# Altium project Protótipo_ProjetoBotão.PrjPcb (part 3 of 4)
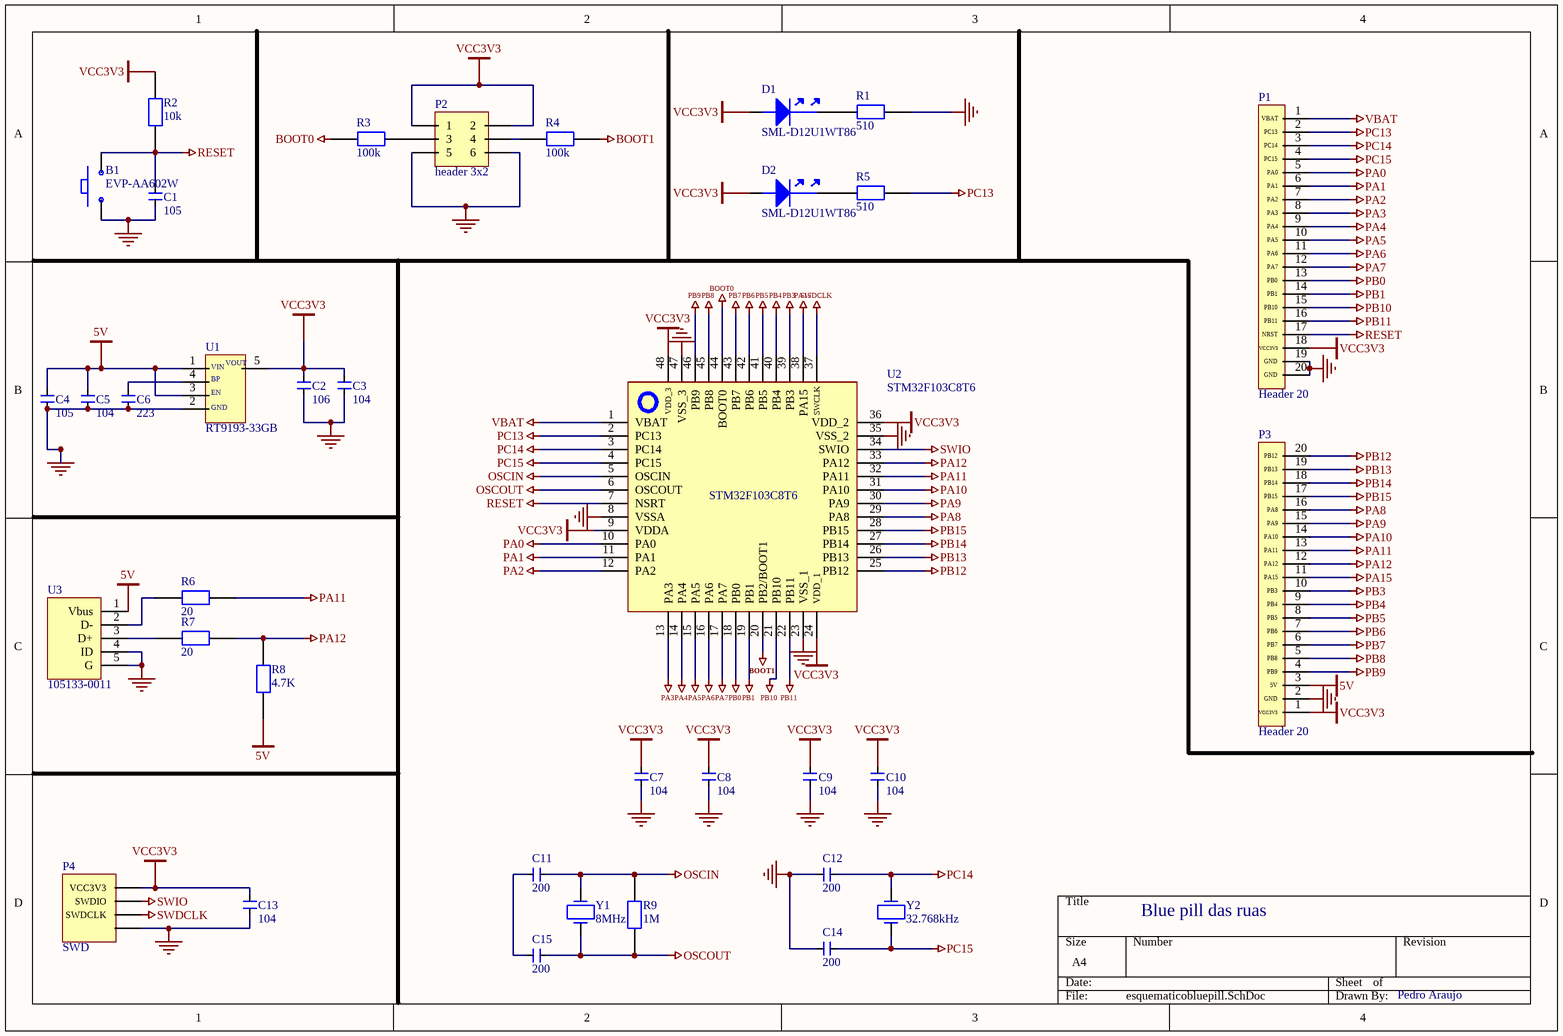
[diagram p3: esquematicobluepill.SchDoc]

## Sheet esquematicobluepill.SchDoc (continued)

### Library data of the parts (continued)
R1 R5 = ERJ-PA3F5100V: Res Thick Film 0603 510 Ohm 1% 0.25W(1/4W) +/-100ppm/C Molded SMD Automotive Punched T/R; Manufacturer: Panasonic; Max Power Dissipation: 250mW; Value: 510Ω; Temperature Coefficient: 100ppm/°C; Voltage Rating: 150V; Supplier: DigiKey; Supplier Part Number: P510BYCT-ND; Manufacturer Part Number: ERJ-PA3F5100V; RoHS: Compliant; Category: Chip SMD Resistors; Stock: 32893; Pricing: 1=0,14, 10=0,068, 25=0,0532, 50=0,0446, 100=0,0378, 250=0,031, 500=0,02712, 1000=0,02404 (USD); Case/Package: 0603; Case Code (Imperial): 0603; Case Code (Metric): 1608; Composition: Thick Film; Depth: 800µm; Features: Automotive AEC-Q200; Height: 450µm; Length: 1.6002mm; Lifecycle Status: Production; Max Operating Temperature: 155°C; Min Operating Temperature: -55°C; Mounting Technology: Surface Mount; Number of Terminals: 2; Number of Terminations: 2; Packaging: Cut Tape; Power Dissipation: 250mW; Power Rating: 250mW; REACH SVHC: Yes; Schedule B: 8533210045, 8533210045|8533210045|8533210045|8533210045|8533210045; Termination: Solder; Tolerance: 1%; Voltage Rating (DC): 150V; Width: 800µm; Working Voltage: 150V; ComponentLink1URL: https://datasheet.octopart.com:443/ERJ-PA3F5100V-Panasonic-datasheet-68299097.pdf?src-supplier=Future+Electronics; ComponentLink1Description: https://datasheet.octopart.com:443/ERJ-PA3F5100V-Panasonic-datasheet-68299097.pdf?src-supplier=Future+Electronics; ComponentLink2URL: https://datasheet.octopart.com:443/ERJ-PA3F5100V-Panasonic-datasheet-136608609.pdf?src-supplier=Farnell; ComponentLink2Description: https://datasheet.octopart.com:443/ERJ-PA3F5100V-Panasonic-datasheet-136608609.pdf?src-supplier=Farnell; ComponentLink3URL: https://datasheet.octopart.com:443/ERJPA3F5100V-Panasonic-datasheet-21212021.pdf?src-supplier=Farnell; ComponentLink3Description: https://datasheet.octopart.com:443/ERJPA3F5100V-Panasonic-datasheet-21212021.pdf?src-supplier=Farnell; ComponentLink4URL: https://datasheet.octopart.com:443/ERJPA3F5100V-Panasonic-datasheet-16484091.pdf?src-supplier=Farnell; ComponentLink4Description: https://datasheet.octopart.com:443/ERJPA3F5100V-Panasonic-datasheet-16484091.pdf?src-supplier=Farnell; ComponentLink5URL: https://datasheet.octopart.com:443/ERJPA3F5100V-Panasonic-datasheet-5389633.pdf?src-supplier=RS+(Formerly+Allied+Electronics); ComponentLink5Description: https://datasheet.octopart.com:443/ERJPA3F5100V-Panasonic-datasheet-5389633.pdf?src-supplier=RS+(Formerly+Allied+Electronics); ComponentLink6URL: https://datasheet.octopart.com:443/ERJPA3F5100V-Panasonic-datasheet-10838877.pdf?src-supplier=element14+APAC; ComponentLink6Description: https://datasheet.octopart.com:443/ERJPA3F5100V-Panasonic-datasheet-10838877.pdf?src-supplier=element14+APAC; ComponentLink7URL: https://datasheet.octopart.com:443/ERJPA3F5100V-Panasonic-datasheet-10403718.pdf?src-supplier=element14+APAC; ComponentLink7Description: https://datasheet.octopart.com:443/ERJPA3F5100V-Panasonic-datasheet-10403718.pdf?src-supplier=element14+APAC; ComponentLink8URL: https://datasheet.octopart.com:443/ERJPA3F5100V-Panasonic-datasheet-10096723.pdf?src-supplier=element14+APAC; ComponentLink8Description: https://datasheet.octopart.com:443/ERJPA3F5100V-Panasonic-datasheet-10096723.pdf?src-supplier=element14+APAC; ComponentLink9URL: https://datasheet.octopart.com:443/ERJPA3F5100V-Panasonic-datasheet-8399050.pdf?src-supplier=element14+APAC; ComponentLink9Description: https://datasheet.octopart.com:443/ERJPA3F5100V-Panasonic-datasheet-8399050.pdf?src-supplier=element14+APAC; ComponentLink10URL: https://datasheet.octopart.com:443/ERJPA3F5100V-Panasonic-datasheet-13272697.pdf?src-supplier=element14+APAC; ComponentLink10Description: https://datasheet.octopart.com:443/ERJPA3F5100V-Panasonic-datasheet-13272697.pdf?src-supplier=element14+APAC; ComponentLink11URL: https://datasheet.octopart.com:443/ERJPA3F5100V-Panasonic-datasheet-60482970.pdf?src-supplier=element14+APAC; ComponentLink11Description: https://datasheet.octopart.com:443/ERJPA3F5100V-Panasonic-datasheet-60482970.pdf?src-supplier=element14+APAC; ComponentLink12URL: https://datasheet.octopart.com:443/ERJPA3F5100V-Panasonic-datasheet-170667599.pdf?src-supplier=TME; ComponentLink12Description: https://datasheet.octopart.com:443/ERJPA3F5100V-Panasonic-datasheet-170667599.pdf?src-supplier=TME; ComponentLink13URL: https://datasheet.octopart.com:443/ERJPA3F5100V-Panasonic-datasheet-164871483.pdf?src-supplier=Burklin+Elektronik; ComponentLink13Description: https://datasheet.octopart.com:443/ERJPA3F5100V-Panasonic-datasheet-164871483.pdf?src-supplier=Burklin+Elektronik; ComponentLink14URL: https://datasheet.octopart.com:443/ERJ-PA3F5100V-Panasonic-datasheet-62334979.pdf?src-supplier=Newark; ComponentLink14Description: https://datasheet.octopart.com:443/ERJ-PA3F5100V-Panasonic-datasheet-62334979.pdf?src-supplier=Newark
R2 = ERJPA3F1002V: Res Thick Film 0603 10K Ohm 1% 0.25W(1/4W) ±100ppm/C Pad SMD Automotive T/R; Manufacturer: Panasonic; Max Power Dissipation: 250mW; Power Rating: 330mW; Value: 10kΩ; Temperature Coefficient: 100ppm/°C; Voltage Rating: 150V; Supplier: DigiKey; Supplier Part Number: P10KBYCT-ND; Manufacturer Part Number: ERJPA3F1002V; RoHS: Compliant; Category: Chip SMD Resistors; Stock: 53972; Pricing: 1=0,14, 10=0,068, 25=0,0532, 50=0,0446, 100=0,0377, 250=0,03096, 500=0,0271, 1000=0,02402 (USD); Case/Package: 0603; Case Code (Imperial): 0603; Case Code (Metric): 1608; Composition: Thick Film; Depth: 800µm; Features: Automotive AEC-Q200; Height: 450µm; Length: 1.6002mm; Lifecycle Status: Production; Max Operating Temperature: 155°C; Min Operating Temperature: -55°C; Mounting Technology: Surface Mount; Number of Terminals: 2; Number of Terminations: 2; Packaging: Cut Tape; Power Dissipation: 250mW; REACH SVHC: Yes; Schedule B: 8533210045, 8533210045|8533210045|8533210045|8533210045|8533210045; Termination: Solder; Tolerance: 1%; Voltage Rating (DC): 150V; Width: 800µm; Working Voltage: 150V; ComponentLink1URL: https://datasheet.octopart.com:443/ERJPA3F1002V-Panasonic-datasheet-182147306.pdf?src-supplier=IHS; ComponentLink1Description: https://datasheet.octopart.com:443/ERJPA3F1002V-Panasonic-datasheet-182147306.pdf?src-supplier=IHS; ComponentLink2URL: https://datasheet.octopart.com:443/ERJPA3F1002V-Panasonic-datasheet-68299097.pdf?src-supplier=ODG+(Origin+Data+Global); ComponentLink2Description: https://datasheet.octopart.com:443/ERJPA3F1002V-Panasonic-datasheet-68299097.pdf?src-supplier=ODG+(Origin+Data+Global); ComponentLink3URL: https://datasheet.octopart.com:443/ERJPA3F1002V-Panasonic-datasheet-136608609.pdf?src-supplier=Newark; ComponentLink3Description: https://datasheet.octopart.com:443/ERJPA3F1002V-Panasonic-datasheet-136608609.pdf?src-supplier=Newark; ComponentLink4URL: https://datasheet.octopart.com:443/ERJ-PA3F1002V-Panasonic-datasheet-62334979.pdf?src-supplier=Newark; ComponentLink4Description: https://datasheet.octopart.com:443/ERJ-PA3F1002V-Panasonic-datasheet-62334979.pdf?src-supplier=Newark; ComponentLink5URL: https://datasheet.octopart.com:443/ERJPA3F1002V-Panasonic-datasheet-5389633.pdf?src-supplier=RS+(Formerly+Allied+Electronics); ComponentLink5Description: https://datasheet.octopart.com:443/ERJPA3F1002V-Panasonic-datasheet-5389633.pdf?src-supplier=RS+(Formerly+Allied+Electronics); ComponentLink6URL: https://datasheet.octopart.com:443/ERJ-PA3F1002V-Panasonic-datasheet-142522929.pdf?src-supplier=Master+Electronics; ComponentLink6Description: https://datasheet.octopart.com:443/ERJ-PA3F1002V-Panasonic-datasheet-142522929.pdf?src-supplier=Master+Electronics; ComponentLink7URL: https://datasheet.octopart.com:443/ERJPA3F1002V-Panasonic-datasheet-10838877.pdf?src-supplier=element14+APAC; ComponentLink7Description: https://datasheet.octopart.com:443/ERJPA3F1002V-Panasonic-datasheet-10838877.pdf?src-supplier=element14+APAC; ComponentLink8URL: https://datasheet.octopart.com:443/ERJPA3F1002V-Panasonic-datasheet-10403718.pdf?src-supplier=element14+APAC; ComponentLink8Description: https://datasheet.octopart.com:443/ERJPA3F1002V-Panasonic-datasheet-10403718.pdf?src-supplier=element14+APAC; ComponentLink9URL: https://datasheet.octopart.com:443/ERJPA3F1002V-Panasonic-datasheet-10096723.pdf?src-supplier=element14+APAC; ComponentLink9Description: https://datasheet.octopart.com:443/ERJPA3F1002V-Panasonic-datasheet-10096723.pdf?src-supplier=element14+APAC; ComponentLink10URL: https://datasheet.octopart.com:443/ERJPA3F1002V-Panasonic-datasheet-8399050.pdf?src-supplier=element14+APAC; ComponentLink10Description: https://datasheet.octopart.com:443/ERJPA3F1002V-Panasonic-datasheet-8399050.pdf?src-supplier=element14+APAC; ComponentLink11URL: https://datasheet.octopart.com:443/ERJPA3F1002V-Panasonic-datasheet-13272697.pdf?src-supplier=element14+APAC; ComponentLink11Description: https://datasheet.octopart.com:443/ERJPA3F1002V-Panasonic-datasheet-13272697.pdf?src-supplier=element14+APAC; ComponentLink12URL: https://datasheet.octopart.com:443/ERJPA3F1002V-Panasonic-datasheet-60482970.pdf?src-supplier=element14+APAC; ComponentLink12Description: https://datasheet.octopart.com:443/ERJPA3F1002V-Panasonic-datasheet-60482970.pdf?src-supplier=element14+APAC; ComponentLink13URL: https://datasheet.octopart.com:443/ERJPA3F1002V-Panasonic-datasheet-21212021.pdf?src-supplier=Farnell; ComponentLink13Description: https://datasheet.octopart.com:443/ERJPA3F1002V-Panasonic-datasheet-21212021.pdf?src-supplier=Farnell; ComponentLink14URL: https://datasheet.octopart.com:443/ERJPA3F1002V-Panasonic-datasheet-16484091.pdf?src-supplier=Farnell; ComponentLink14Description: https://datasheet.octopart.com:443/ERJPA3F1002V-Panasonic-datasheet-16484091.pdf?src-supplier=Farnell; ComponentLink15URL: https://datasheet.octopart.com:443/ERJPA3F1002V-Panasonic-datasheet-170667599.pdf?src-supplier=TME; ComponentLink15Description: https://datasheet.octopart.com:443/ERJPA3F1002V-Panasonic-datasheet-170667599.pdf?src-supplier=TME; ComponentLink16URL: https://datasheet.octopart.com:443/ERJPA3F1002V-Panasonic-datasheet-164871483.pdf?src-supplier=Burklin+Elektronik; ComponentLink16Description: https://datasheet.octopart.com:443/ERJPA3F1002V-Panasonic-datasheet-164871483.pdf?src-supplier=Burklin+Elektronik
R3 R4 = ERJ-3EKF1003V: Resistor Thick Film 0603 100K Ohm 1% 1/10W 100ppm/C Molded SMD Punched Carrier T/R; Manufacturer: Panasonic; Max Power Dissipation: 100mW; Value: 100kΩ; Temperature Coefficient: 100ppm/°C; Voltage Rating: 75V; Supplier: DigiKey; Supplier Part Number: P100KHCT-ND; Manufacturer Part Number: ERJ-3EKF1003V; RoHS: Compliant; Category: Chip SMD Resistors; Stock: 91754; Pricing: 1=0,1, 10=0,034, 25=0,0256, 50=0,021, 100=0,0173, 250=0,01364, 500=0,01158, 1000=0,01021 (USD); Case/Package: 0603; Case Code (Imperial): 0603; China RoHS: Non-Compliant; Composition: Thick Film; Contact Plating: Tin; Depth: 800µm; Features: Automotive AEC-Q200; Height: 450µm; Lead Free: Lead Free; Length: 1.6mm; Lifecycle Status: Production; Max Operating Temperature: 155°C; Military Standard: Not; Min Operating Temperature: -55°C; Mounting Technology: Surface Mount; Pins: 2; Number of Terminals: 2; Number of Terminations: 2; Packaging: Cut Tape; Power Dissipation: 100mW; Power Rating: 100mW; Radiation Hardening: No; REACH SVHC: Yes; Schedule B: 8533210045, 8533210045|8533210045|8533210045|8533210045|8533210045|8533210045|8533210045|8533210045|8533210045|8533210045|8533210045|8533210045|8533210045|8533210045|8533210045|8533210045|8533210045|8533210045|8533210045|8533210045|8533210045|8533210045|8533210045|85; Termination: SMD/SMT; Tolerance: 1%; Voltage Rating (DC): 75V; Weight: 2.012816mg; Width: 800µm; Working Voltage: 75V; ComponentLink1URL: https://datasheet.octopart.com:443/ERJ3EKF1003V-Panasonic-datasheet-182147282.pdf?src-supplier=IHS; ComponentLink1Description: https://datasheet.octopart.com:443/ERJ3EKF1003V-Panasonic-datasheet-182147282.pdf?src-supplier=IHS; ComponentLink2URL: https://datasheet.octopart.com:443/ERJ-3EKF1003V-Panasonic-datasheet-82288794.pdf?src-supplier=Future+Electronics; ComponentLink2Description: https://datasheet.octopart.com:443/ERJ-3EKF1003V-Panasonic-datasheet-82288794.pdf?src-supplier=Future+Electronics; ComponentLink3URL: https://datasheet.octopart.com:443/ERJ-3EKF1003V-Panasonic-datasheet-10025800.pdf?src-supplier=Future+Electronics; ComponentLink3Description: https://datasheet.octopart.com:443/ERJ-3EKF1003V-Panasonic-datasheet-10025800.pdf?src-supplier=Future+Electronics; ComponentLink4URL: https://datasheet.octopart.com:443/ERJ-3EKF1003V-Panasonic-datasheet-8853621.pdf?src-supplier=Future+Electronics; ComponentLink4Description: https://datasheet.octopart.com:443/ERJ-3EKF1003V-Panasonic-datasheet-8853621.pdf?src-supplier=Future+Electronics; ComponentLink5URL: https://datasheet.octopart.com:443/ERJ-3EKF1003V-Panasonic-datasheet-13266541.pdf?src-supplier=Newark; ComponentLink5Description: https://datasheet.octopart.com:443/ERJ-3EKF1003V-Panasonic-datasheet-13266541.pdf?src-supplier=Newark; ComponentLink6URL: https://datasheet.octopart.com:443/ERJ-3EKF1003V-Panasonic-datasheet-5313456.pdf?src-supplier=Newark; ComponentLink6Description: https://datasheet.octopart.com:443/ERJ-3EKF1003V-Panasonic-datasheet-5313456.pdf?src-supplier=Newark; ComponentLink7URL: https://datasheet.octopart.com:443/ERJ-3EKF1003V-Panasonic-datasheet-48891056.pdf?src-supplier=Newark; ComponentLink7Description: https://datasheet.octopart.com:443/ERJ-3EKF1003V-Panasonic-datasheet-48891056.pdf?src-supplier=Newark; ComponentLink8URL: https://datasheet.octopart.com:443/ERJ-3EKF1003V-Panasonic-datasheet-168681906.pdf?src-supplier=Newark; ComponentLink8Description: https://datasheet.octopart.com:443/ERJ-3EKF1003V-Panasonic-datasheet-168681906.pdf?src-supplier=Newark; ComponentLink9URL: https://datasheet.octopart.com:443/ERJ-3EKF1003V-Panasonic-datasheet-136608610.pdf?src-supplier=Burklin+Elektronik; ComponentLink9Description: https://datasheet.octopart.com:443/ERJ-3EKF1003V-Panasonic-datasheet-136608610.pdf?src-supplier=Burklin+Elektronik; ComponentLink10URL: https://datasheet.octopart.com:443/ERJ-3EKF1003V-Panasonic-datasheet-154766169.pdf?src-supplier=Master+Electronics; ComponentLink10Description: https://datasheet.octopart.com:443/ERJ-3EKF1003V-Panasonic-datasheet-154766169.pdf?src-supplier=Master+Electronics; ComponentLink11URL: https://datasheet.octopart.com:443/ERJ3EKF1003V-Panasonic-datasheet-138819429.pdf?src-supplier=TME; ComponentLink11Description: https://datasheet.octopart.com:443/ERJ3EKF1003V-Panasonic-datasheet-138819429.pdf?src-supplier=TME; ComponentLink12URL: https://datasheet.octopart.com/ERJ-3EKF1003V-Panasonic-datasheet-78375410.pdf; ComponentLink12Description: https://datasheet.octopart.com/ERJ-3EKF1003V-Panasonic-datasheet-78375410.pdf; ComponentLink13URL: https://datasheet.octopart.com/Precision-Thick-Film-Chip-Resistors-Panasonic-datasheet-family-106.pdf; ComponentLink13Description: https://datasheet.octopart.com/Precision-Thick-Film-Chip-Resistors-Panasonic-datasheet-family-106.pdf; ComponentLink14URL: https://datasheet.octopart.com:443/ERJ-3EKF1003V-Panasonic-datasheet-11542829.pdf?src-supplier=Arrow+Electronics; ComponentLink14Description: https://datasheet.octopart.com:443/ERJ-3EKF1003V-Panasonic-datasheet-11542829.pdf?src-supplier=Arrow+Electronics; ComponentLink15URL: https://datasheet.octopart.com:443/ERJ-3EKF1003V-Panasonic-datasheet-7538305.pdf?src-supplier=Jameco; ComponentLink15Description: https://datasheet.octopart.com:443/ERJ-3EKF1003V-Panasonic-datasheet-7538305.pdf?src-supplier=Jameco; ComponentLink16URL: https://datasheet.octopart.com:443/ERJ-3EKF1003V-Panasonic-datasheet-118621.pdf?src-supplier=DigiKey; ComponentLink16Description: https://datasheet.octopart.com:443/ERJ-3EKF1003V-Panasonic-datasheet-118621.pdf?src-supplier=DigiKey; ComponentLink17URL: https://datasheet.octopart.com:443/ERJ-3EKF1003V-Panasonic-datasheet-41391857.pdf?src-supplier=Electro+Sonic; ComponentLink17Description: https://datasheet.octopart.com:443/ERJ-3EKF1003V-Panasonic-datasheet-41391857.pdf?src-supplier=Electro+Sonic
R6 R7 = ERJPA3F20R0V: Res Thick Film 0603 20 Ohm 1% 0.25W(1/4W) ±100ppm/C Molded SMD Automotive Punched T/R; Manufacturer: Panasonic; Max Power Dissipation: 250mW; Value: 20Ω; Temperature Coefficient: 100ppm/°C; Voltage Rating: 150V; Supplier: DigiKey; Supplier Part Number: P20.00BYCT-ND; Manufacturer Part Number: ERJPA3F20R0V; RoHS: Compliant; Category: Chip SMD Resistors; Stock: 29181; Pricing: 1=0,14, 10=0,068, 25=0,0532, 50=0,0446, 100=0,0378, 250=0,031, 500=0,02712, 1000=0,02404 (USD); Case/Package: 0603; Case Code (Imperial): 0603; Case Code (Metric): 1608; Composition: Thick Film; Depth: 800µm; Features: Automotive AEC-Q200; Height: 450µm; Length: 1.6002mm; Lifecycle Status: Production; Max Operating Temperature: 155°C; Min Operating Temperature: -55°C; Mounting Technology: Surface Mount; Number of Terminals: 2; Number of Terminations: 2; Packaging: Cut Tape; Power Dissipation: 250mW; Power Rating: 250mW; REACH SVHC: Yes; Schedule B: 8533210045, 8533210045|8533210045, 8533210045|8533210045|8533210045, 8533210045|8533210045|8533210045|8533210045; Termination: Solder; Tolerance: 1%; Voltage Rating (DC): 150V; Width: 800µm; Working Voltage: 150V; ComponentLink1URL: https://datasheet.octopart.com:443/ERJPA3F20R0V-Panasonic-datasheet-182147306.pdf?src-supplier=IHS; ComponentLink1Description: https://datasheet.octopart.com:443/ERJPA3F20R0V-Panasonic-datasheet-182147306.pdf?src-supplier=IHS; ComponentLink2URL: https://datasheet.octopart.com:443/ERJPA3F20R0V-Panasonic-datasheet-68299097.pdf?src-supplier=Future+Electronics; ComponentLink2Description: https://datasheet.octopart.com:443/ERJPA3F20R0V-Panasonic-datasheet-68299097.pdf?src-supplier=Future+Electronics; ComponentLink3URL: https://datasheet.octopart.com:443/ERJPA3F20R0V-Panasonic-datasheet-136608609.pdf?src-supplier=Newark; ComponentLink3Description: https://datasheet.octopart.com:443/ERJPA3F20R0V-Panasonic-datasheet-136608609.pdf?src-supplier=Newark; ComponentLink4URL: https://datasheet.octopart.com:443/ERJ-PA3F20R0V-Panasonic-datasheet-62334979.pdf?src-supplier=Newark; ComponentLink4Description: https://datasheet.octopart.com:443/ERJ-PA3F20R0V-Panasonic-datasheet-62334979.pdf?src-supplier=Newark; ComponentLink5URL: https://datasheet.octopart.com:443/ERJPA3F20R0V-Panasonic-datasheet-5389633.pdf?src-supplier=RS+(Formerly+Allied+Electronics); ComponentLink5Description: https://datasheet.octopart.com:443/ERJPA3F20R0V-Panasonic-datasheet-5389633.pdf?src-supplier=RS+(Formerly+Allied+Electronics); ComponentLink6URL: https://datasheet.octopart.com:443/ERJPA3F20R0V-Panasonic-datasheet-10838877.pdf?src-supplier=element14+APAC; ComponentLink6Description: https://datasheet.octopart.com:443/ERJPA3F20R0V-Panasonic-datasheet-10838877.pdf?src-supplier=element14+APAC; ComponentLink7URL: https://datasheet.octopart.com:443/ERJPA3F20R0V-Panasonic-datasheet-10403718.pdf?src-supplier=element14+APAC; ComponentLink7Description: https://datasheet.octopart.com:443/ERJPA3F20R0V-Panasonic-datasheet-10403718.pdf?src-supplier=element14+APAC; ComponentLink8URL: https://datasheet.octopart.com:443/ERJPA3F20R0V-Panasonic-datasheet-10096723.pdf?src-supplier=element14+APAC; ComponentLink8Description: https://datasheet.octopart.com:443/ERJPA3F20R0V-Panasonic-datasheet-10096723.pdf?src-supplier=element14+APAC; ComponentLink9URL: https://datasheet.octopart.com:443/ERJPA3F20R0V-Panasonic-datasheet-8399050.pdf?src-supplier=element14+APAC; ComponentLink9Description: https://datasheet.octopart.com:443/ERJPA3F20R0V-Panasonic-datasheet-8399050.pdf?src-supplier=element14+APAC; ComponentLink10URL: https://datasheet.octopart.com:443/ERJPA3F20R0V-Panasonic-datasheet-13272697.pdf?src-supplier=element14+APAC; ComponentLink10Description: https://datasheet.octopart.com:443/ERJPA3F20R0V-Panasonic-datasheet-13272697.pdf?src-supplier=element14+APAC; ComponentLink11URL: https://datasheet.octopart.com:443/ERJPA3F20R0V-Panasonic-datasheet-60482970.pdf?src-supplier=element14+APAC; ComponentLink11Description: https://datasheet.octopart.com:443/ERJPA3F20R0V-Panasonic-datasheet-60482970.pdf?src-supplier=element14+APAC; ComponentLink12URL: https://datasheet.octopart.com:443/ERJPA3F20R0V-Panasonic-datasheet-21212021.pdf?src-supplier=Farnell; ComponentLink12Description: https://datasheet.octopart.com:443/ERJPA3F20R0V-Panasonic-datasheet-21212021.pdf?src-supplier=Farnell; ComponentLink13URL: https://datasheet.octopart.com:443/ERJPA3F20R0V-Panasonic-datasheet-16484091.pdf?src-supplier=Farnell; ComponentLink13Description: https://datasheet.octopart.com:443/ERJPA3F20R0V-Panasonic-datasheet-16484091.pdf?src-supplier=Farnell; ComponentLink14URL: https://datasheet.octopart.com:443/ERJPA3F20R0V-Panasonic-datasheet-164871483.pdf?src-supplier=Burklin+Elektronik; ComponentLink14Description: https://datasheet.octopart.com:443/ERJPA3F20R0V-Panasonic-datasheet-164871483.pdf?src-supplier=Burklin+Elektronik
R8 = ERJ-PA3F4701V: Res Thick Film 0603 4.7K Ohm 1% 0.25W(1/4W) ±100ppm/C Pad SMD Automotive T/R; Manufacturer: Panasonic; Max Power Dissipation: 250mW; Power Rating: 330mW; Value: 4.7kΩ; Temperature Coefficient: 100ppm/°C; Voltage Rating: 150V; Supplier: DigiKey; Supplier Part Number: P4.7KBYCT-ND; Manufacturer Part Number: ERJ-PA3F4701V; RoHS: Compliant; Category: Chip SMD Resistors; Stock: 73624; Pricing: 1=0,14, 10=0,068, 25=0,0532, 50=0,0446, 100=0,0377, 250=0,03096, 500=0,0271, 1000=0,02402 (USD); Case/Package: 0603; Case Code (Imperial): 0603; Case Code (Metric): 1608; Composition: Thick Film; Contact Plating: Tin; Depth: 800µm; Features: Automotive AEC-Q200; Height: 450µm; Length: 1.6002mm; Lifecycle Status: Production; Max Operating Temperature: 155°C; Min Operating Temperature: -55°C; Mounting Technology: Surface Mount; Number of Terminals: 2; Number of Terminations: 2; Packaging: Cut Tape; Power Dissipation: 250mW; REACH SVHC: Yes; Schedule B: 8533210045, 8533210045|8533210045|8533210045|8533210045|8533210045|8533210045|8533210045|8533210045|8533210045|8533210045|8533210045|8533210045|8533210045|8533210045|8533210045|8533210045|8533210045|8533210045|8533210045|8533210045|8533210045|8533210045|8533210045|85; Termination: Solder; Tolerance: 1%; Voltage Rating (DC): 150V; Width: 800µm; Working Voltage: 150V; ComponentLink1URL: https://datasheet.octopart.com:443/ERJ-PA3F4701V-Panasonic-datasheet-68299097.pdf?src-supplier=Future+Electronics; ComponentLink1Description: https://datasheet.octopart.com:443/ERJ-PA3F4701V-Panasonic-datasheet-68299097.pdf?src-supplier=Future+Electronics; ComponentLink2URL: https://datasheet.octopart.com:443/ERJ-PA3F4701V-Panasonic-datasheet-142522929.pdf?src-supplier=JRH+Electronics; ComponentLink2Description: https://datasheet.octopart.com:443/ERJ-PA3F4701V-Panasonic-datasheet-142522929.pdf?src-supplier=JRH+Electronics; ComponentLink3URL: https://datasheet.octopart.com:443/ERJ-PA3F4701V-Panasonic-datasheet-136608609.pdf?src-supplier=Farnell; ComponentLink3Description: https://datasheet.octopart.com:443/ERJ-PA3F4701V-Panasonic-datasheet-136608609.pdf?src-supplier=Farnell; ComponentLink4URL: https://datasheet.octopart.com:443/ERJPA3F4701V-Panasonic-datasheet-21212021.pdf?src-supplier=Farnell; ComponentLink4Description: https://datasheet.octopart.com:443/ERJPA3F4701V-Panasonic-datasheet-21212021.pdf?src-supplier=Farnell; ComponentLink5URL: https://datasheet.octopart.com:443/ERJPA3F4701V-Panasonic-datasheet-16484091.pdf?src-supplier=Farnell; ComponentLink5Description: https://datasheet.octopart.com:443/ERJPA3F4701V-Panasonic-datasheet-16484091.pdf?src-supplier=Farnell; ComponentLink6URL: https://datasheet.octopart.com:443/ERJPA3F4701V-Panasonic-datasheet-10838877.pdf?src-supplier=element14+APAC; ComponentLink6Description: https://datasheet.octopart.com:443/ERJPA3F4701V-Panasonic-datasheet-10838877.pdf?src-supplier=element14+APAC; ComponentLink7URL: https://datasheet.octopart.com:443/ERJPA3F4701V-Panasonic-datasheet-10403718.pdf?src-supplier=element14+APAC; ComponentLink7Description: https://datasheet.octopart.com:443/ERJPA3F4701V-Panasonic-datasheet-10403718.pdf?src-supplier=element14+APAC; ComponentLink8URL: https://datasheet.octopart.com:443/ERJPA3F4701V-Panasonic-datasheet-10096723.pdf?src-supplier=element14+APAC; ComponentLink8Description: https://datasheet.octopart.com:443/ERJPA3F4701V-Panasonic-datasheet-10096723.pdf?src-supplier=element14+APAC; ComponentLink9URL: https://datasheet.octopart.com:443/ERJPA3F4701V-Panasonic-datasheet-8399050.pdf?src-supplier=element14+APAC; ComponentLink9Description: https://datasheet.octopart.com:443/ERJPA3F4701V-Panasonic-datasheet-8399050.pdf?src-supplier=element14+APAC; ComponentLink10URL: https://datasheet.octopart.com:443/ERJPA3F4701V-Panasonic-datasheet-5389633.pdf?src-supplier=element14+APAC; ComponentLink10Description: https://datasheet.octopart.com:443/ERJPA3F4701V-Panasonic-datasheet-5389633.pdf?src-supplier=element14+APAC; ComponentLink11URL: https://datasheet.octopart.com:443/ERJPA3F4701V-Panasonic-datasheet-13272697.pdf?src-supplier=element14+APAC; ComponentLink11Description: https://datasheet.octopart.com:443/ERJPA3F4701V-Panasonic-datasheet-13272697.pdf?src-supplier=element14+APAC; ComponentLink12URL: https://datasheet.octopart.com:443/ERJPA3F4701V-Panasonic-datasheet-60482970.pdf?src-supplier=element14+APAC; ComponentLink12Description: https://datasheet.octopart.com:443/ERJPA3F4701V-Panasonic-datasheet-60482970.pdf?src-supplier=element14+APAC; ComponentLink13URL: https://datasheet.octopart.com:443/ERJPA3F4701V-Panasonic-datasheet-170667599.pdf?src-supplier=TME; ComponentLink13Description: https://datasheet.octopart.com:443/ERJPA3F4701V-Panasonic-datasheet-170667599.pdf?src-supplier=TME; ComponentLink14URL: https://datasheet.octopart.com:443/ERJPA3F4701V-Panasonic-datasheet-164871483.pdf?src-supplier=Burklin+Elektronik; ComponentLink14Description: https://datasheet.octopart.com:443/ERJPA3F4701V-Panasonic-datasheet-164871483.pdf?src-supplier=Burklin+Elektronik; ComponentLink15URL: https://datasheet.octopart.com:443/ERJ-PA3F4701V-Panasonic-datasheet-62334979.pdf?src-supplier=Newark; ComponentLink15Description: https://datasheet.octopart.com:443/ERJ-PA3F4701V-Panasonic-datasheet-62334979.pdf?src-supplier=Newark
R9 = ERJ-PA3F1004V: Res Thick Film 0603 1M Ohm 1% 0.25W(1/4W) ±100ppm/C Pad SMD Automotive T/R; Manufacturer: Panasonic; Max Power Dissipation: 250mW; Value: 1MΩ; Temperature Coefficient: 100ppm/°C; Voltage Rating: 150V; Supplier: DigiKey; Supplier Part Number: P1.0MBYCT-ND; Manufacturer Part Number: ERJ-PA3F1004V; RoHS: Compliant; Category: Chip SMD Resistors; Stock: 257397; Pricing: 1=0,14, 10=0,068, 25=0,0532, 50=0,0446, 100=0,0377, 250=0,03096, 500=0,0271, 1000=0,02402 (USD); Case/Package: 0603; Case Code (Imperial): 0603; Case Code (Metric): 1608; Composition: Thick Film; Depth: 800µm; Features: Automotive AEC-Q200; Height: 450µm; Length: 1.6002mm; Lifecycle Status: Production; Max Operating Temperature: 155°C; Min Operating Temperature: -55°C; Mounting Technology: Surface Mount; Number of Terminals: 2; Number of Terminations: 2; Packaging: Cut Tape; Power Dissipation: 250mW; Power Rating: 250mW; REACH SVHC: Yes; Schedule B: 8533210045, 8533210045|8533210045|8533210045|8533210045|8533210045|8533210045|8533210045|8533210045|8533210045|8533210045|8533210045|8533210045|8533210045|8533210045|8533210045|8533210045|8533210045|8533210045|8533210045|8533210045|8533210045|8533210045|8533210045|85; Termination: Solder; Tolerance: 1%; Voltage Rating (DC): 150V; Width: 800µm; Working Voltage: 150V; ComponentLink1URL: https://datasheet.octopart.com:443/ERJ-PA3F1004V-Panasonic-datasheet-68299097.pdf?src-supplier=Future+Electronics; ComponentLink1Description: https://datasheet.octopart.com:443/ERJ-PA3F1004V-Panasonic-datasheet-68299097.pdf?src-supplier=Future+Electronics; ComponentLink2URL: https://datasheet.octopart.com:443/ERJ-PA3F1004V-Panasonic-datasheet-136608609.pdf?src-supplier=Farnell; ComponentLink2Description: https://datasheet.octopart.com:443/ERJ-PA3F1004V-Panasonic-datasheet-136608609.pdf?src-supplier=Farnell; ComponentLink3URL: https://datasheet.octopart.com:443/ERJPA3F1004V-Panasonic-datasheet-21212021.pdf?src-supplier=Farnell; ComponentLink3Description: https://datasheet.octopart.com:443/ERJPA3F1004V-Panasonic-datasheet-21212021.pdf?src-supplier=Farnell; ComponentLink4URL: https://datasheet.octopart.com:443/ERJPA3F1004V-Panasonic-datasheet-16484091.pdf?src-supplier=Farnell; ComponentLink4Description: https://datasheet.octopart.com:443/ERJPA3F1004V-Panasonic-datasheet-16484091.pdf?src-supplier=Farnell; ComponentLink5URL: https://datasheet.octopart.com:443/ERJPA3F1004V-Panasonic-datasheet-5389633.pdf?src-supplier=RS+(Formerly+Allied+Electronics); ComponentLink5Description: https://datasheet.octopart.com:443/ERJPA3F1004V-Panasonic-datasheet-5389633.pdf?src-supplier=RS+(Formerly+Allied+Electronics); ComponentLink6URL: https://datasheet.octopart.com:443/ERJ-PA3F1004V-Panasonic-datasheet-142522929.pdf?src-supplier=Master+Electronics; ComponentLink6Description: https://datasheet.octopart.com:443/ERJ-PA3F1004V-Panasonic-datasheet-142522929.pdf?src-supplier=Master+Electronics; ComponentLink7URL: https://datasheet.octopart.com:443/ERJPA3F1004V-Panasonic-datasheet-10838877.pdf?src-supplier=element14+APAC; ComponentLink7Description: https://datasheet.octopart.com:443/ERJPA3F1004V-Panasonic-datasheet-10838877.pdf?src-supplier=element14+APAC; ComponentLink8URL: https://datasheet.octopart.com:443/ERJPA3F1004V-Panasonic-datasheet-10403718.pdf?src-supplier=element14+APAC; ComponentLink8Description: https://datasheet.octopart.com:443/ERJPA3F1004V-Panasonic-datasheet-10403718.pdf?src-supplier=element14+APAC; ComponentLink9URL: https://datasheet.octopart.com:443/ERJPA3F1004V-Panasonic-datasheet-10096723.pdf?src-supplier=element14+APAC; ComponentLink9Description: https://datasheet.octopart.com:443/ERJPA3F1004V-Panasonic-datasheet-10096723.pdf?src-supplier=element14+APAC; ComponentLink10URL: https://datasheet.octopart.com:443/ERJPA3F1004V-Panasonic-datasheet-8399050.pdf?src-supplier=element14+APAC; ComponentLink10Description: https://datasheet.octopart.com:443/ERJPA3F1004V-Panasonic-datasheet-8399050.pdf?src-supplier=element14+APAC; ComponentLink11URL: https://datasheet.octopart.com:443/ERJPA3F1004V-Panasonic-datasheet-13272697.pdf?src-supplier=element14+APAC; ComponentLink11Description: https://datasheet.octopart.com:443/ERJPA3F1004V-Panasonic-datasheet-13272697.pdf?src-supplier=element14+APAC; ComponentLink12URL: https://datasheet.octopart.com:443/ERJPA3F1004V-Panasonic-datasheet-60482970.pdf?src-supplier=element14+APAC; ComponentLink12Description: https://datasheet.octopart.com:443/ERJPA3F1004V-Panasonic-datasheet-60482970.pdf?src-supplier=element14+APAC; ComponentLink13URL: https://datasheet.octopart.com:443/ERJPA3F1004V-Panasonic-datasheet-170667599.pdf?src-supplier=TME; ComponentLink13Description: https://datasheet.octopart.com:443/ERJPA3F1004V-Panasonic-datasheet-170667599.pdf?src-supplier=TME; ComponentLink14URL: https://datasheet.octopart.com:443/ERJPA3F1004V-Panasonic-datasheet-164871483.pdf?src-supplier=Burklin+Elektronik; ComponentLink14Description: https://datasheet.octopart.com:443/ERJPA3F1004V-Panasonic-datasheet-164871483.pdf?src-supplier=Burklin+Elektronik; ComponentLink15URL: https://datasheet.octopart.com:443/ERJ-PA3F1004V-Panasonic-datasheet-62334979.pdf?src-supplier=Newark; ComponentLink15Description: https://datasheet.octopart.com:443/ERJ-PA3F1004V-Panasonic-datasheet-62334979.pdf?src-supplier=Newark
U1 = RT9193-33GB: RT9193 Series 300 mA 3.3 V Ultra-Low Noise Ultra-Fast CMOS LDO Regulator-SC-70-5; Manufacturer: Richtek; Dropout Voltage: 220mV; Max Supply Voltage: 5.5V; Max Junction Temperature (Tj): 125°C; Min Current Limit: 360mA; Min Input Voltage: 4.3V; Nominal Output Voltage: 3.3V; Number of Circuits: 1; Output Current: 300mA; Voltage Tolerance: 2%; Supplier: DigiKey; Supplier Part Number: 1028-1014-1-ND; Manufacturer Part Number: RT9193-33GB; RoHS: Compliant; Category: LDO Voltage Regulators; Stock: 6266; Pricing: 1=0,41, 10=0,283, 25=0,2516, 100=0,2178, 250=0,20156, 500=0,19182, 1000=0,18377 (USD); Case/Package: SOT-23-5; Height - Seated (Max): 1.295mm; Lead Free: Lead Free; Length: 2.89mm; Lifecycle Status: Production; Max Operating Temperature: 85°C; Min Operating Temperature: -40°C; Mounting Technology: Surface Mount; Number of Outputs: 1; Pins: 5; Number of Regulators: 1; Number of Terminals: 5; Output Voltage: 3.3V; REACH SVHC: Yes; Terminal Pitch: 950µm; Width: 1.6mm; ComponentLink1URL: https://datasheet.octopart.com:443/RT9193-33GB-Richtek-datasheet-181204355.pdf?src-supplier=ODG+(Origin+Data+Global); ComponentLink1Description: https://datasheet.octopart.com:443/RT9193-33GB-Richtek-datasheet-181204355.pdf?src-supplier=ODG+(Origin+Data+Global); ComponentLink2URL: https://datasheet.octopart.com:443/RT9193-33GB-Richtek-datasheet-103962855.pdf?src-supplier=Augswan; ComponentLink2Description: https://datasheet.octopart.com:443/RT9193-33GB-Richtek-datasheet-103962855.pdf?src-supplier=Augswan; ComponentLink3URL: https://datasheet.octopart.com:443/RT9193-33GB-Richtek-datasheet-140440429.pdf?src-supplier=LKR; ComponentLink3Description: https://datasheet.octopart.com:443/RT9193-33GB-Richtek-datasheet-140440429.pdf?src-supplier=LKR; ComponentLink4URL: https://datasheet.octopart.com:443/RT9193-33GB-Richtek-datasheet-21631297.pdf?src-supplier=element14+APAC; ComponentLink4Description: https://datasheet.octopart.com:443/RT9193-33GB-Richtek-datasheet-21631297.pdf?src-supplier=element14+APAC; ComponentLink5URL: https://datasheet.octopart.com:443/RT9193-33GB-Richtek-datasheet-21405099.pdf?src-supplier=Future+Electronics; ComponentLink5Description: https://datasheet.octopart.com:443/RT9193-33GB-Richtek-datasheet-21405099.pdf?src-supplier=Future+Electronics; ComponentLink6URL: https://datasheet.octopart.com:443/RT9193-33GB-Richtek-datasheet-12517944.pdf?src-supplier=Future+Electronics; ComponentLink6Description: https://datasheet.octopart.com:443/RT9193-33GB-Richtek-datasheet-12517944.pdf?src-supplier=Future+Electronics; ComponentLink7URL: https://datasheet.octopart.com:443/RT9193-33GB-Richtek-datasheet-14171959.pdf?src-supplier=iiiC; ComponentLink7Description: https://datasheet.octopart.com:443/RT9193-33GB-Richtek-datasheet-14171959.pdf?src-supplier=iiiC
U2 = STM32F103C8T6: MCU 32-bit STM32F1 ARM Cortex M3 RISC 64KB Flash 2.5V/3.3V 48-Pin LQFP Tray; Manufacturer: STMicroelectronics; Manufacturer Package Identifier: ai14911d; Address Bus Width: 32b; Clock Rate: 16MHz; Density: 512kb; EEPROM Memory Size: 0B; Frequency: 72MHz; Interface: CAN, USB; Max Power Dissipation: 363mW; Max Supply Current: 50mA; Max Supply Voltage: 3.6V; Min Supply Voltage: 2V; Nominal Supply Current: 1.7µA; Number of A/D Converters: 2; Number of ADC Channels: 10; Number of Bits: 32; Number of I/Os: 37; Number of Interrupts: 16; Number of Programmable I/O: 48; Number of PWM Channels: 1; Number of Timers/Counters: 4; Number of USART Channels: 3; Operating Supply Voltage: 3.3V; Oscillator Type: Internal; Peripherals: DMA, I2C, POR, PWM, Temp Sensor, WDT; RAM Size: 20kB; Watchdog Timer: Yes; Supplier: DigiKey; Supplier Part Number: 497-6063-ND; Manufacturer Part Number: STM32F103C8T6; RoHS: Compliant; Category: Microcontrollers; Stock: 5582; Pricing: 1=6,08, 10=4,662, 25=4,3084, 100=3,9192, 250=3,73372, 500=3,6219, 1000=3,5299, 2500=3,43276 (USD); Case/Package: LQFP; China RoHS: Compliant; Core Architecture: ARM; Data Bus Width: 32b; Flash Memory Size: 64kB; Height: 1.45mm; Height - Seated (Max): 1.6mm; Lead Free: Lead Free; Length: 7mm; Lifecycle Status: Production; Clock Frequency: 72MHz; Max Operating Temperature: 85°C; Memory Size: 64kB; Memory Format: FLASH; Min Operating Temperature: -40°C; Mounting Technology: Surface Mount; Number of Channels: 10; Number of I2C Channels: 2; Pins: 48; Number of SPI Channels: 2; Number of Terminals: 48; Radiation Hardening: No; REACH SVHC: Yes; Schedule B: 8542310000; Terminal Pitch: 500µm; Termination: SMD/SMT; Width: 7mm; ComponentLink1URL: https://datasheet.octopart.com:443/STM32F103C8T6-STMicroelectronics-datasheet-48026265.pdf?src-supplier=ICpick; ComponentLink1Description: https://datasheet.octopart.com:443/STM32F103C8T6-STMicroelectronics-datasheet-48026265.pdf?src-supplier=ICpick; ComponentLink2URL: https://datasheet.octopart.com:443/STM32F103C8T6-STMicroelectronics-datasheet-10330614.pdf?src-supplier=Newark; ComponentLink2Description: https://datasheet.octopart.com:443/STM32F103C8T6-STMicroelectronics-datasheet-10330614.pdf?src-supplier=Newark; ComponentLink3URL: https://datasheet.octopart.com:443/STM32F103C8T6-STMicroelectronics-datasheet-16839800.pdf?src-supplier=Newark; ComponentLink3Description: https://datasheet.octopart.com:443/STM32F103C8T6-STMicroelectronics-datasheet-16839800.pdf?src-supplier=Newark; ComponentLink4URL: https://datasheet.octopart.com:443/STM32F103C8T6-STMicroelectronics-datasheet-14363502.pdf?src-supplier=Farnell; ComponentLink4Description: https://datasheet.octopart.com:443/STM32F103C8T6-STMicroelectronics-datasheet-14363502.pdf?src-supplier=Farnell; ComponentLink5URL: https://datasheet.octopart.com:443/STM32F103C8T6-STMicroelectronics-datasheet-500013.pdf?src-supplier=Farnell; ComponentLink5Description: https://datasheet.octopart.com:443/STM32F103C8T6-STMicroelectronics-datasheet-500013.pdf?src-supplier=Farnell; ComponentLink6URL: https://datasheet.octopart.com:443/STM32F103C8T6-STMicroelectronics-datasheet-8365036.pdf?src-supplier=Farnell; ComponentLink6Description: https://datasheet.octopart.com:443/STM32F103C8T6-STMicroelectronics-datasheet-8365036.pdf?src-supplier=Farnell; ComponentLink7URL: https://datasheet.octopart.com:443/STM32F103C8T6-STMicroelectronics-datasheet-6396519.pdf?src-supplier=Verical; ComponentLink7Description: https://datasheet.octopart.com:443/STM32F103C8T6-STMicroelectronics-datasheet-6396519.pdf?src-supplier=Verical; ComponentLink8URL: https://datasheet.octopart.com:443/STM32F103C8T6-STMicroelectronics-datasheet-21407612.pdf?src-supplier=element14+APAC; ComponentLink8Description: https://datasheet.octopart.com:443/STM32F103C8T6-STMicroelectronics-datasheet-21407612.pdf?src-supplier=element14+APAC; ComponentLink9URL: https://datasheet.octopart.com:443/STM32F103C8T6-STMicroelectronics-datasheet-8700640.pdf?src-supplier=element14; ComponentLink9Description: https://datasheet.octopart.com:443/STM32F103C8T6-STMicroelectronics-datasheet-8700640.pdf?src-supplier=element14; ComponentLink10URL: https://datasheet.octopart.com:443/STM32F103C8T6-STMicroelectronics-datasheet-177520228.pdf?src-supplier=Burklin+Elektronik; ComponentLink10Description: https://datasheet.octopart.com:443/STM32F103C8T6-STMicroelectronics-datasheet-177520228.pdf?src-supplier=Burklin+Elektronik; ComponentLink11URL: https://datasheet.octopart.com:443/STM32F103C8T6-STMicroelectronics-datasheet-165583531.pdf?src-supplier=SOS+electronic; ComponentLink11Description: https://datasheet.octopart.com:443/STM32F103C8T6-STMicroelectronics-datasheet-165583531.pdf?src-supplier=SOS+electronic; ComponentLink12URL: https://datasheet.octopart.com:443/STM32F103C8T6-STMicroelectronics-datasheet-14106722.pdf?src-supplier=iiiC; ComponentLink12Description: https://datasheet.octopart.com:443/STM32F103C8T6-STMicroelectronics-datasheet-14106722.pdf?src-supplier=iiiC; ComponentLink13URL: https://datasheet.octopart.com:443/STM32F103C8T6-STMicroelectronics-datasheet-17594274.pdf?src-supplier=TME; ComponentLink13Description: https://datasheet.octopart.com:443/STM32F103C8T6-STMicroelectronics-datasheet-17594274.pdf?src-supplier=TME; ComponentLink14URL: https://datasheet.octopart.com:443/STM32F103C8T6-STMicroelectronics-datasheet-148251.pdf?src-supplier=Nu+Horizons; ComponentLink14Description: https://datasheet.octopart.com:443/STM32F103C8T6-STMicroelectronics-datasheet-148251.pdf?src-supplier=Nu+Horizons
U3 = 105133-0011: Conn Micro USB 2.0 Type B RCP 5 POS 0.65mm Solder ST SMD 5 Terminal 1 Port Micro-USB T/R; Manufacturer: Molex; Manufacturer Lifecycle Status: ACTIVE; Contact Resistance: 30mΩ; Current Rating: 1A; Dielectric Material: Polyethylene; Gender: Female; Insulation Resistance: 1GΩ; Max Voltage Rating (AC): 30V; Number of Circuits: 5; Number of Ports: 1; Pitch: 650µm; Plating: Gold; USB Standard: USB 2.0; Supplier: DigiKey; Supplier Part Number: WM10134CT-ND; Manufacturer Part Number: 105133-0011; RoHS: Compliant; Category: USB Connectors; Stock: 11180; Pricing: 1=1,19, 10=1,014, 25=0,9504, 50=0,9048, 100=0,8616, 250=0,80764, 500=0,71146, 1000=0,6775, 1500=0,65839, 2500=0,63509, 3500=0,62019, 5000=0,60479, 12500=0,56696 (USD); China RoHS: Compliant; Color: Black; Connector Type: USB; Contact Gender: Female; Contact Material: Brass; Contact Plating: Gold; Country of Origin: TW; Depth: 4.45mm; Flammability Rating: UL94 V-0; Halogen Free: Low Halogen; Height: 6.95mm; Housing Material: Thermoplastic; Lead Free: Lead Free; Length: 8mm; Lifecycle Status: Production; Max Operating Temperature: 85°C; Min Operating Temperature: -30°C; Mounting Technology: Surface Mount, Vertical; Number of Contacts: 5; Pins: 5; Number of Rows: 1; Number of Terminals: 5; Orientation: Right Angle, Vertical; Packaging: Tape & Reel (TR); REACH SVHC: Yes; Schedule B: 8536695050, 8536695050|8536695050, 8536695050|8536695050|8536695050, 8536695050|8536695050|8536695050|8536695050; Shell Material: Stainless Steel; Terminal Pitch: 660.4µm; Termination: Solder; Voltage Rating: 30V; Voltage Rating (AC): 30V; ComponentLink1URL: https://sigma.octopart.com:443/142372729/technical_drawing/Molex-1051330011.pdf?src-supplier=Upverter; ComponentLink1Description: https://sigma.octopart.com:443/142372729/technical_drawing/Molex-1051330011.pdf?src-supplier=Upverter; ComponentLink2URL: https://datasheet.octopart.com:443/1051330011-Molex-datasheet-142372715.pdf?src-supplier=Upverter; ComponentLink2Description: https://datasheet.octopart.com:443/1051330011-Molex-datasheet-142372715.pdf?src-supplier=Upverter; ComponentLink3URL: https://datasheet.octopart.com:443/105133-0011-Molex-datasheet-62059206.pdf?src-supplier=TME; ComponentLink3Description: https://datasheet.octopart.com:443/105133-0011-Molex-datasheet-62059206.pdf?src-supplier=TME; ComponentLink4URL: https://datasheet.octopart.com:443/1051330011-Molex-datasheet-16324372.pdf?src-supplier=Sager+Electronics; ComponentLink4Description: https://datasheet.octopart.com:443/1051330011-Molex-datasheet-16324372.pdf?src-supplier=Sager+Electronics; ComponentLink5URL: https://sigma.octopart.com:443/16324376/technical_drawing/Molex-1051330011.pdf?src-supplier=Molex; ComponentLink5Description: https://sigma.octopart.com:443/16324376/technical_drawing/Molex-1051330011.pdf?src-supplier=Molex; ComponentLink6URL: https://datasheet.octopart.com:443/105133-0011-Molex-datasheet-66419580.pdf?src-supplier=element14+APAC; ComponentLink6Description: https://datasheet.octopart.com:443/105133-0011-Molex-datasheet-66419580.pdf?src-supplier=element14+APAC; ComponentLink7URL: https://datasheet.octopart.com:443/105133-0011-Molex-datasheet-140174749.pdf?src-supplier=RS+(Formerly+Allied+Electronics); ComponentLink7Description: https://datasheet.octopart.com:443/105133-0011-Molex-datasheet-140174749.pdf?src-supplier=RS+(Formerly+Allied+Electronics); ComponentLink8URL: https://datasheet.octopart.com:443/105133-0011-Molex-datasheet-120135192.pdf?src-supplier=RS+(Formerly+Allied+Electronics); ComponentLink8Description: https://datasheet.octopart.com:443/105133-0011-Molex-datasheet-120135192.pdf?src-supplier=RS+(Formerly+Allied+Electronics); ComponentLink9URL: https://datasheet.octopart.com:443/1051330011-Molex-datasheet-137316104.pdf?src-supplier=Future+Electronics; ComponentLink9Description: https://datasheet.octopart.com:443/1051330011-Molex-datasheet-137316104.pdf?src-supplier=Future+Electronics; ComponentLink10URL: http://sigma.octopart.com:80/16324374/rohs_statement/Molex-1051330011.pdf?src-supplier=Compliance+Statements; ComponentLink10Description: http://sigma.octopart.com:80/16324374/rohs_statement/Molex-1051330011.pdf?src-supplier=Compliance+Statements; ComponentLink11URL: http://sigma.octopart.com:80/conflict_mineral_statement/Molex-company-72.pdf?src-supplier=Compliance+Statements; ComponentLink11Description: http://sigma.octopart.com:80/conflict_mineral_statement/Molex-company-72.pdf?src-supplier=Compliance+Statements; ComponentLink12URL: http://sigma.octopart.com:80/rohs_statement/Molex-company-73.pdf?src-supplier=Compliance+Statements; ComponentLink12Description: http://sigma.octopart.com:80/rohs_statement/Molex-company-73.pdf?src-supplier=Compliance+Statements; ComponentLink13URL: http://sigma.octopart.com:80/reach_statement/Molex-company-74.pdf?src-supplier=Compliance+Statements; ComponentLink13Description: http://sigma.octopart.com:80/reach_statement/Molex-company-74.pdf?src-supplier=Compliance+Statements
Y1 = FC4SDCBMF8.0-T1: Crystal 8MHz ±30ppm (Tol) ±50ppm (Stability) 20pF FUND 80Ohm 2-Pin HC-49/SDLF SMD T/R; Manufacturer: Fox Electronics; Frequency Tolerance: 0.003%; ESR: 80Ω; Supplier: DigiKey; Supplier Part Number: 631-FC4SDCBMF8.0-T1CT-ND; Manufacturer Part Number: FC4SDCBMF8.0-T1; RoHS: Compliant; Category: Crystals; Stock: 13146; Pricing: 1=0,24, 10=0,208, 25=0,1968, 50=0,1888, 100=0,181, 250=0,17116, 500=0,16406 (USD); China RoHS: Compliant; Frequency: 8MHz; Frequency Stability: 50ppm; Load Capacitance: 20pF; Max Operating Temperature: 70°C; Min Operating Temperature: -20°C; Mounting Technology: Surface Mount; REACH SVHC: Yes; Schedule B: 8541600025, 8541600025|8541600025, 8541600025|8541600025|8541600025, 8541600025|8541600025|8541600025|8541600025; ComponentLink1URL: https://datasheet.octopart.com:443/FC4SDCBMF8.0-T1-Fox-Electronics-datasheet-81464241.pdf?src-supplier=IHS; ComponentLink1Description: https://datasheet.octopart.com:443/FC4SDCBMF8.0-T1-Fox-Electronics-datasheet-81464241.pdf?src-supplier=IHS; ComponentLink2URL: https://datasheet.octopart.com:443/FC4SDCBMF8.0-T1-Fox-Electronics-datasheet-189100413.pdf?src-supplier=Master+Electronics; ComponentLink2Description: https://datasheet.octopart.com:443/FC4SDCBMF8.0-T1-Fox-Electronics-datasheet-189100413.pdf?src-supplier=Master+Electronics; ComponentLink3URL: https://datasheet.octopart.com:443/FC4SDCBMF8.0-T1-Fox-Electronics-datasheet-136840669.pdf?src-supplier=Future+Electronics; ComponentLink3Description: https://datasheet.octopart.com:443/FC4SDCBMF8.0-T1-Fox-Electronics-datasheet-136840669.pdf?src-supplier=Future+Electronics; ComponentLink4URL: http://sigma.octopart.com:80/conflict_mineral_statement/Fox-Electronics-company-38.pdf?src-supplier=Compliance+Statements; ComponentLink4Description: http://sigma.octopart.com:80/conflict_mineral_statement/Fox-Electronics-company-38.pdf?src-supplier=Compliance+Statements; ComponentLink5URL: http://sigma.octopart.com:80/reach_statement/Fox-Electronics-company-39.pdf?src-supplier=Compliance+Statements; ComponentLink5Description: http://sigma.octopart.com:80/reach_statement/Fox-Electronics-company-39.pdf?src-supplier=Compliance+Statements
Y2 = ABS06-32.768KHZ-1-T: Crystal, 32.7680KHZ, 12.5PF SMD, 2.0 X 1.2 x 0.6 mm, ABS06 Series | Abracon ABS06-32.768KHz-1-T; ESR (Equivalent Series Resistance): 90kΩ; Frequency Stability: 144ppm; Frequency Tolerance: 0.001%; Supplier: DigiKey; Supplier Part Number: 535-10248-1-ND; Manufacturer: Abracon; Manufacturer Part Number: ABS06-32.768KHZ-1-T; RoHS: Compliant; Category: Crystals; Stock: 361730; Pricing: 1=0,69, 10=0,604, 25=0,5712, 50=0,5476, 100=0,5249, 250=0,4964, 500=0,47586, 1000=0,45617 (USD); Case/Package: CSMD; China RoHS: Compliant; Contact Plating: Gold; Depth: 1.2mm; Frequency: 32.768kHz; Height: 600µm; Lead Free: Lead Free; Length: 2mm; Lifecycle Status: Production; Load Capacitance: 12.5pF; Max Operating Temperature: 85°C; Min Operating Temperature: -40°C; Mounting Technology: Surface Mount; Pins: 2; Packaging: Cut Tape; Radiation Hardening: No; REACH SVHC: Yes; Schedule B: 8541600025; ESR: 90kΩ; Termination: SMD/SMT; Tolerance: 0.001%; Width: 1.2mm; ComponentLink1URL: https://datasheet.octopart.com:443/ABS06-32.768KHZ-1-T-Abracon-datasheet-166807294.pdf?src-supplier=IHS; ComponentLink1Description: https://datasheet.octopart.com:443/ABS06-32.768KHZ-1-T-Abracon-datasheet-166807294.pdf?src-supplier=IHS; ComponentLink2URL: https://datasheet.octopart.com:443/ABS06-32.768KHZ-1-T-Abracon-datasheet-41191558.pdf?src-supplier=element14+APAC; ComponentLink2Description: https://datasheet.octopart.com:443/ABS06-32.768KHZ-1-T-Abracon-datasheet-41191558.pdf?src-supplier=element14+APAC; ComponentLink3URL: https://datasheet.octopart.com:443/ABS06-32.768KHZ-1-T-Abracon-datasheet-10980089.pdf?src-supplier=Sager+Electronics; ComponentLink3Description: https://datasheet.octopart.com:443/ABS06-32.768KHZ-1-T-Abracon-datasheet-10980089.pdf?src-supplier=Sager+Electronics; ComponentLink4URL: https://datasheet.octopart.com:443/ABS06-32.768KHZ-1-T-Abracon-datasheet-8509249.pdf?src-supplier=Sager+Electronics; ComponentLink4Description: https://datasheet.octopart.com:443/ABS06-32.768KHZ-1-T-Abracon-datasheet-8509249.pdf?src-supplier=Sager+Electronics; ComponentLink5URL: https://datasheet.octopart.com:443/ABS06-32.768KHZ-1-T-Abracon-datasheet-154833176.pdf?src-supplier=TME; ComponentLink5Description: https://datasheet.octopart.com:443/ABS06-32.768KHZ-1-T-Abracon-datasheet-154833176.pdf?src-supplier=TME; ComponentLink6URL: https://datasheet.octopart.com:443/ABS06-32.768KHZ-1-T-Abracon-datasheet-37124832.pdf?src-supplier=Farnell; ComponentLink6Description: https://datasheet.octopart.com:443/ABS06-32.768KHZ-1-T-Abracon-datasheet-37124832.pdf?src-supplier=Farnell; ComponentLink7URL: http://sigma.octopart.com:80/conflict_mineral_statement/Abracon-company-27.pdf?src-supplier=Compliance+Statements; ComponentLink7Description: http://sigma.octopart.com:80/conflict_mineral_statement/Abracon-company-27.pdf?src-supplier=Compliance+Statements